# Altium schematic sheet MM_2.0_sch.SchDoc
size C; SheetNumber: 1; SheetTotal: 1
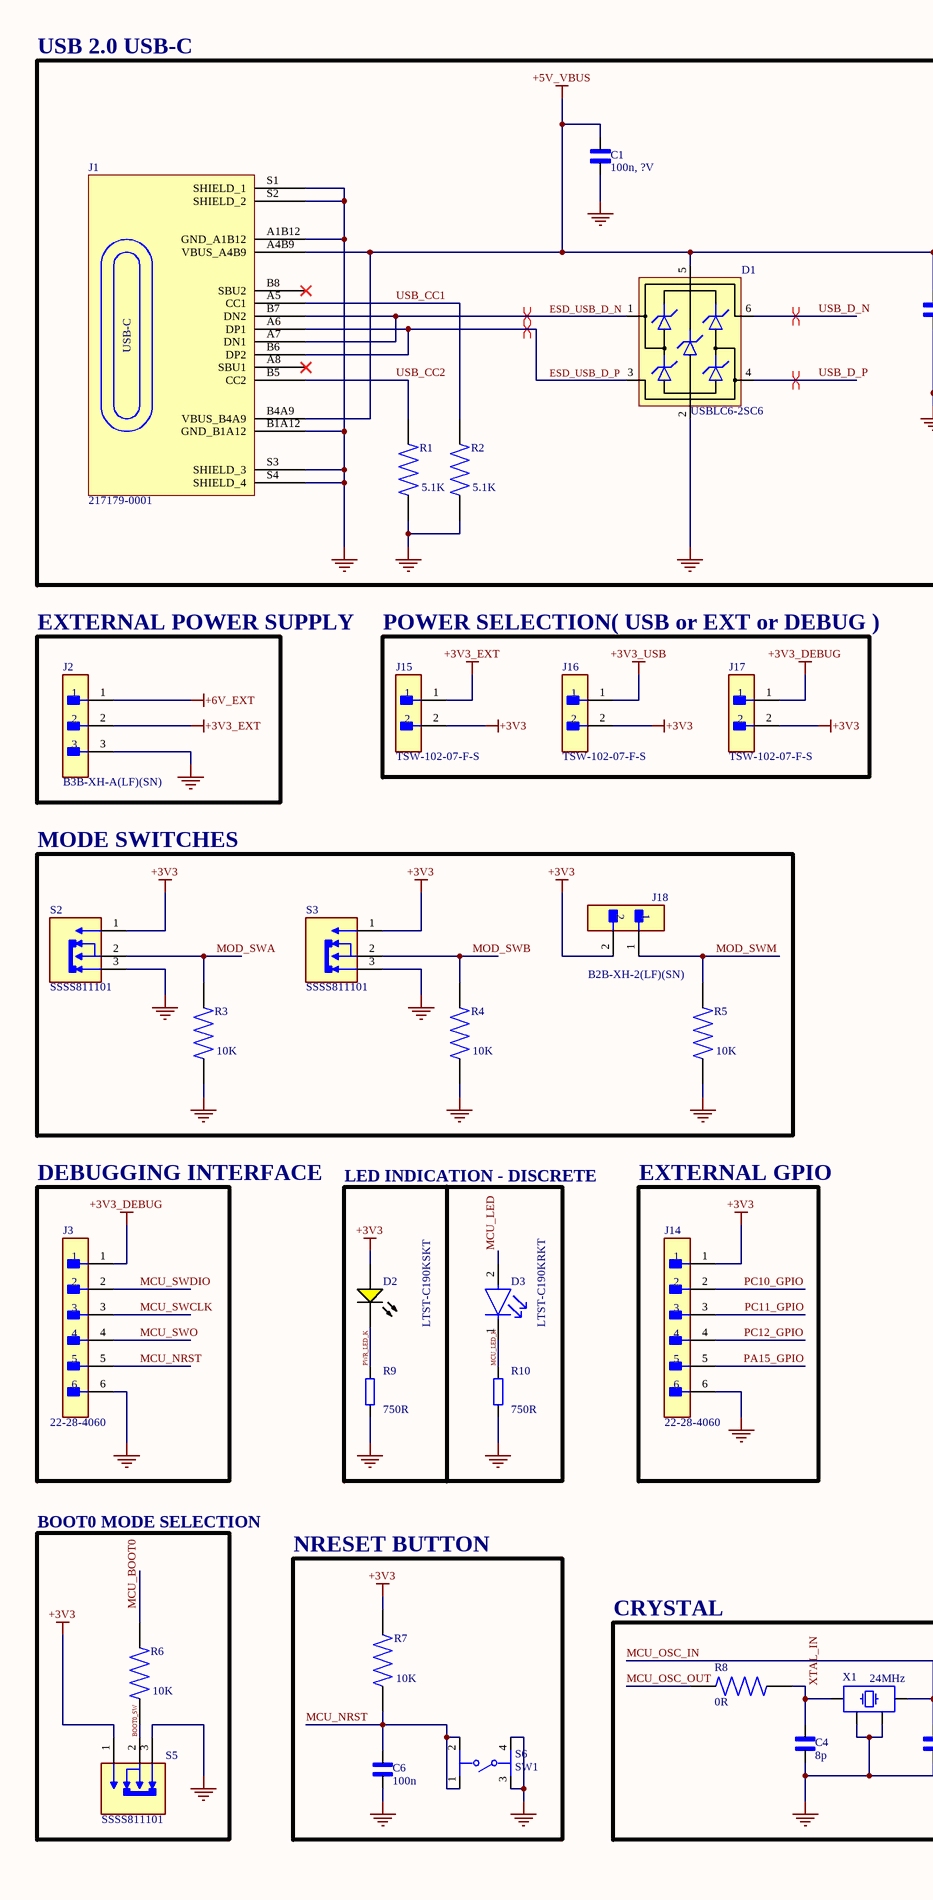
[diagram p0: MM_2.0_sch.SchDoc, left]
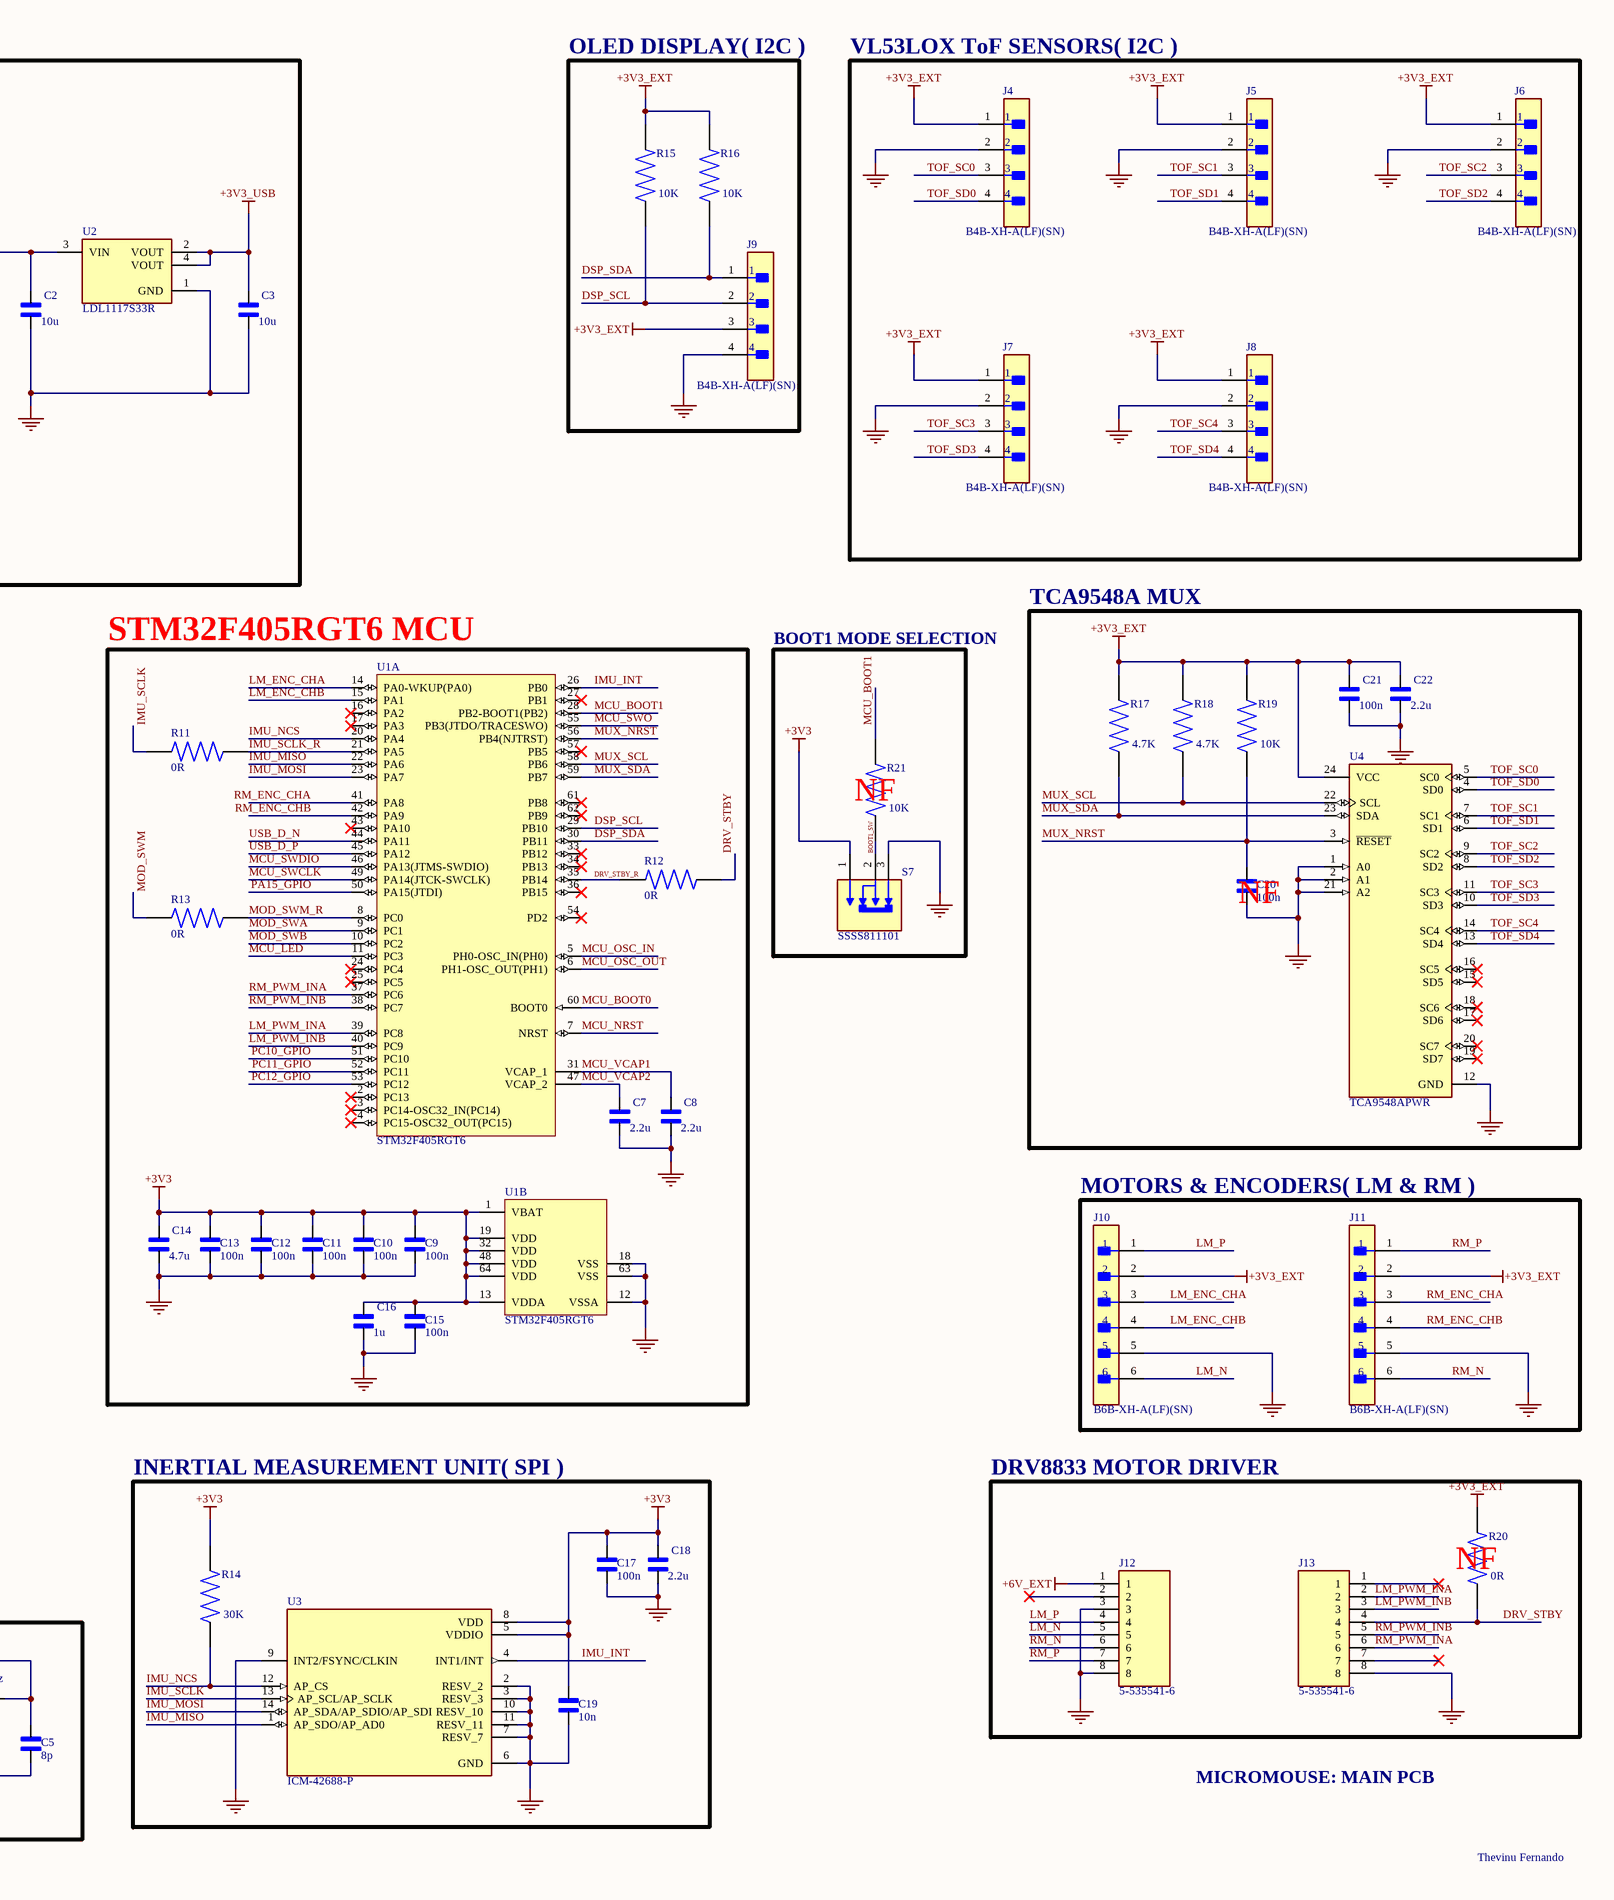
[diagram p1: MM_2.0_sch.SchDoc, right]

## Parts
C1  100n, ?V  [CAP_0402]
C2  10u  [CAPC2012X140N]
C3  10u  [CAPC2012X140N]
C4  8p  [CAP_0402]
C5  8p  [CAP_0402]
C6  100n  [CAP_0402]
C7  2.2u  [CL10A105KO8NNNC 4.7u 16V 603]
C8  2.2u  [CL10A105KO8NNNC 4.7u 16V 603]
C9  100n  [CAP_0402]
C10  100n  [CAP_0402]
C11  100n  [CAP_0402]
C12  100n  [CAP_0402]
C13  100n  [CAP_0402]
C14  4.7u  [CL10A105KO8NNNC 4.7u 16V 603]
C15  100n  [CAP_0402]
C16  1u  [CL10A105KO8NNNC 1u 16V 603]
C17  100n  [CAP_0402]
C18  2.2u  [CL10A105KO8NNNC 4.7u 16V 603]
C19  10n  [CAP_0402]
C20  100n  [CAP_0402]
C21  100n  [CAP_0402]
C22  2.2u  [CL10A105KO8NNNC 4.7u 16V 603]
D1  USBLC6-2SC6  [SOT95P280X145-6N]
D2  LTST-C190KSKT  [LTST-C190KSKT_V]
D3  LTST-C190KRKT  [FP-LTST-C190KRKT-MFG]
J1  217179-0001  [FP-2171790001-MFG USB-C 2.0]
J2  B3B-XH-A(LF)(SN)  [FP-B3B-XH-A_LF_SN-MFG]
J3  22-28-4060  [FP-22-28-4060-MFG]
J4  B4B-XH-A(LF)(SN)  [FP-B4B-XH-A_LF_SN-MFG]
J5  B4B-XH-A(LF)(SN)  [FP-B4B-XH-A_LF_SN-MFG]
J6  B4B-XH-A(LF)(SN)  [FP-B4B-XH-A_LF_SN-MFG]
J7  B4B-XH-A(LF)(SN)  [FP-B4B-XH-A_LF_SN-MFG]
J8  B4B-XH-A(LF)(SN)  [FP-B4B-XH-A_LF_SN-MFG]
J9  B4B-XH-A(LF)(SN)  [FP-B4B-XH-A_LF_SN-MFG]
J10  B6B-XH-A(LF)(SN)  [FP-B6B-XH-A_LF_SN-MFG]
J11  B6B-XH-A(LF)(SN)  [FP-B6B-XH-A_LF_SN-MFG]
J12  5-535541-6  [TE_5-535541-6]
J13  5-535541-6  [TE_5-535541-6]
J14  22-28-4060  [FP-22-28-4060-MFG]
J15  TSW-102-07-F-S  [FP-TSW-102-07-F-S-MFG]
J16  TSW-102-07-F-S  [FP-TSW-102-07-F-S-MFG]
J17  TSW-102-07-F-S  [FP-TSW-102-07-F-S-MFG]
J18  B2B-XH-2(LF)(SN)  [FP-B2B-XH-2_LF_SN-MFG]
R1  5.1K  [RES_ERJ2RKF1002X 100K 100mW 402]
R2  5.1K  [RES_ERJ2RKF1002X 100K 100mW 402]
R3  10K  [RES_ERJ2RKF1002X 100K 100mW 402]
R4  10K  [RES_ERJ2RKF1002X 100K 100mW 402]
R5  10K  [RES_ERJ2RKF1002X 100K 100mW 402]
R6  10K  [RES_ERJ2RKF1002X 100K 100mW 402]
R7  10K  [RES_ERJ2RKF1002X 100K 100mW 402]
R8  0R  [RES_ERJ2RKF1002X 100K 100mW 402]
R9  750R  [RES_0603]
R10  750R  [RES_0603]
R11  0R  [RES_ERJ2RKF1002X 100K 100mW 402]
R12  0R  [RES_ERJ2RKF1002X 100K 100mW 402]
R13  0R  [RES_ERJ2RKF1002X 100K 100mW 402]
R14  30K  [RES_ERJ2RKF1002X 100K 100mW 402]
R15  10K  [RES_ERJ2RKF1002X 100K 100mW 402]
R16  10K  [RES_ERJ2RKF1002X 100K 100mW 402]
R17  4.7K  [RES_ERJ2RKF1002X 100K 100mW 402]
R18  4.7K  [RES_ERJ2RKF1002X 100K 100mW 402]
R19  10K  [RES_ERJ2RKF1002X 100K 100mW 402]
R20  0R  [RES_ERJ2RKF1002X 100K 100mW 402]
R21  10K  [RES_ERJ2RKF1002X 100K 100mW 402]
S2  SSSS811101  [SW_SSSS811101]
S3  SSSS811101  [SW_SSSS811101]
S5  SSSS811101  [SW_SSSS811101]
S6  SW1  [FP-PTS645SM43SMTR92LFS-MFG]
S7  SSSS811101  [SW_SSSS811101]
U1  STM32F405RGT6  [STM-LQFP64_L]  (parts A,B of 2)
U2  LDL1117S33R  [FP-SOT223-0046067-IPC_A]
U3  ICM-42688-P  [PQFN50P300X250X97-14N]
U4  TCA9548APWR  [FP-PW0024A-IPC_A]
X1  24MHz  [XTAL_3225]

## Blocks framed on the sheet
USB 2.0 USB-C: C1-C3 D1 J1 R1 R2 U2
OLED DISPLAY( I2C ): J9 R15 R16
VL53LOX ToF SENSORS( I2C ): J4-J8
EXTERNAL POWER SUPPLY: J2
POWER SELECTION( USB or EXT or DEBUG ): J15-J17
NF: C20-C22 R17-R19 U4
STM32F405RGT6 MCU: C7-C16 R11-R13 U1
NF: R21 S7
MODE SWITCHES: J18 R3-R5 S2 S3
DEBUGGING INTERFACE: J3
LED INDICATION - DISCRETE: D2 D3 R9 R10
EXTERNAL GPIO: J14
MOTORS & ENCODERS( LM & RM ): J10 J11
INERTIAL MEASUREMENT UNIT( SPI ): C17-C19 R14 U3
NF: J12 J13 R20
BOOT0 MODE SELECTION: R6 S5
NRESET BUTTON: C6 R7 S6
CRYSTAL: C4 C5 R8 X1

## Nets
+3V3: C9.2 C10.2 C11.2 C12.2 C13.2 C14.1 C15.2 C16.1 C17.2 C18.1 C19.2 D2.1(A) J14.1 J15.2 J16.2 J17.2 J18.2 R7.2 R14.2 S2.1 S3.1 S5.1 S7.1 U1.1(VBAT) U1.13(VDDA) U1.19(VDD) U1.32(VDD) U1.48(VDD) U1.64(VDD) U3.5(VDDIO) U3.8(VDD)
+3V3_DEBUG: J3.1 J17.1
+3V3_EXT: C21.2 C22.1 J2.2 J4.1 J5.1 J6.1 J7.1 J8.1 J9.3 J10.2 J11.2 J15.1 R15.2 R16.2 R17.2 R18.2 R19.2 R20.2 U4.24(VCC)
+3V3_USB: C3.1 J16.1 U2.2(VOUT) U2.4(VOUT)
+5V_VBUS: C1.2 C2.1 D1.5(VBUS) J1.A4B9(VBUS_A4B9) J1.B4A9(VBUS_B4A9) U2.3(VIN)
+6V_EXT: J2.1 J12.1
GND: C1.1 C2.2 C3.2 C4.1 C5.1 C6.1 C7.2 C8.2 C9.1 C10.1 C11.1 C12.1 C13.1 C14.2 C15.1 C16.2 C17.1 C18.2 C19.1 C20.1 C21.1 C22.2 D1.2(GND) J1.A1B12(GND_A1B12) J1.B1A12(GND_B1A12) J1.S1(SHIELD_1) J1.S2(SHIELD_2) J1.S3(SHIELD_3) J1.S4(SHIELD_4) J2.3 J3.6 J4.2 J5.2 J6.2 J7.2 J8.2 J9.4 J10.5 J11.5 J12.3 J12.8 J13.8 J14.6 R1.1 R2.1 R3.1 R4.1 R5.1 R9.1 R10.1 S2.3 S3.3 S5.3 S6.3 S6.4 S7.3 U1.12(VSSA) U1.18(VSS) U1.63(VSS) U2.1(GND) U3.2(RESV_2) U3.3(RESV_3) U3.6(GND) U3.7(RESV_7) U3.9(INT2/FSYNC/CLKIN) U3.10(RESV_10) U3.11(RESV_11) U4.1(A0) U4.2(A1) U4.12(GND) U4.21(A2) X1.2 X1.4
BOOT0_SW: R6.1 S5.2
BOOT1_SW: R21.1 S7.2
DRV_STBY: J13.4 R12.2 R20.1
DRV_STBY_R: R12.1 U1.35(PB14)
DSP_SCL: J9.2 R15.1 U1.29(PB10)
DSP_SDA: J9.1 R16.1 U1.30(PB11)
ESD_USB_D_N: D1.1(IO1) J1.A7(DN1) J1.B7(DN2)
ESD_USB_D_P: D1.3(IO2) J1.A6(DP1) J1.B6(DP2)
IMU_INT: U1.26(PB0) U3.4(INT1/INT)
IMU_MISO: U1.22(PA6) U3.1(AP_SDO/AP_AD0)
IMU_MOSI: U1.23(PA7) U3.14(AP_SDA/AP_SDIO/AP_SDI)
IMU_NCS: R14.1 U1.20(PA4) U3.12(AP_CS)
IMU_SCLK: R11.1 U3.13(AP_SCL/AP_SCLK)
IMU_SCLK_R: R11.2 U1.21(PA5)
LM_ENC_CHA: J10.3 U1.14(PA0-WKUP(PA0))
LM_ENC_CHB: J10.4 U1.15(PA1)
LM_N: J10.6 J12.5
LM_P: J10.1 J12.4
LM_PWM_INA: J13.2 U1.39(PC8)
LM_PWM_INB: J13.3 U1.40(PC9)
MCU_BOOT0: R6.2 U1.60(BOOT0)
MCU_BOOT1: R21.2 U1.28(PB2-BOOT1(PB2))
MCU_LED: D3.2(A) U1.11(PC3)
MCU_LED_K: D3.1(C) R10.2
MCU_NRST: C6.2 J3.5 R7.1 S6.1 S6.2 U1.7(NRST)
MCU_OSC_IN: C5.2 U1.5(PH0-OSC_IN(PH0)) X1.3
MCU_OSC_OUT: R8.1 U1.6(PH1-OSC_OUT(PH1))
MCU_SWCLK: J3.3 U1.49(PA14(JTCK-SWCLK))
MCU_SWDIO: J3.2 U1.46(PA13(JTMS-SWDIO))
MCU_SWO: J3.4 U1.55(PB3(JTDO/TRACESWO))
MCU_VCAP1: C8.1 U1.31(VCAP_1)
MCU_VCAP2: C7.1 U1.47(VCAP_2)
MOD_SWA: R3.2 S2.2 U1.9(PC1)
MOD_SWB: R4.2 S3.2 U1.10(PC2)
MOD_SWM: J18.1 R5.2 R13.1
MOD_SWM_R: R13.2 U1.8(PC0)
MUX_NRST: C20.2 R19.1 U1.56(PB4(NJTRST)) U4.3(~{RESET})
MUX_SCL: R18.1 U1.58(PB6) U4.22(SCL)
MUX_SDA: R17.1 U1.59(PB7) U4.23(SDA)
PA15_GPIO: J14.5 U1.50(PA15(JTDI))
PC10_GPIO: J14.2 U1.51(PC10)
PC11_GPIO: J14.3 U1.52(PC11)
PC12_GPIO: J14.4 U1.53(PC12)
PWR_LED_K: D2.2(K) R9.2
RM_ENC_CHA: J11.3 U1.41(PA8)
RM_ENC_CHB: J11.4 U1.42(PA9)
RM_N: J11.6 J12.6
RM_P: J11.1 J12.7
RM_PWM_INA: J13.6 U1.37(PC6)
RM_PWM_INB: J13.5 U1.38(PC7)
TOF_SC0: J4.3 U4.5(SC0)
TOF_SC1: J5.3 U4.7(SC1)
TOF_SC2: J6.3 U4.9(SC2)
TOF_SC3: J7.3 U4.11(SC3)
TOF_SC4: J8.3 U4.14(SC4)
TOF_SD0: J4.4 U4.4(SD0)
TOF_SD1: J5.4 U4.6(SD1)
TOF_SD2: J6.4 U4.8(SD2)
TOF_SD3: J7.4 U4.10(SD3)
TOF_SD4: J8.4 U4.13(SD4)
USB_CC1: J1.A5(CC1) R2.2
USB_CC2: J1.B5(CC2) R1.2
USB_D_N: D1.6(IO1) U1.44(PA11)
USB_D_P: D1.4(IO2) U1.45(PA12)
XTAL_IN: C4.2 R8.2 X1.1

Not connected (* = marked no-connect by the designer): J1 A8(SBU1)* B8(SBU2)*; J12 2*; J13 1* 7*; U1 2(PC13)* 3(PC14-OSC32_IN(PC14))* 4(PC15-OSC32_OUT(PC15))* 16(PA2)* 17(PA3)* 24(PC4)* 25(PC5)* 27(PB1)* 33(PB12)* 34(PB13)* 36(PB15)* 43(PA10)* 54(PD2)* 57(PB5)* 61(PB8)* 62(PB9)*; U4 15(SD5)* 16(SC5)* 17(SD6)* 18(SC6)* 19(SD7)* 20(SC7)*

## Layout directives
differential pair; differential pair class DIFF_USB: USB_D_N, USB_D_P
differential pair; differential pair class ESD_DIFF_USB: ESD_USB_D_N, ESD_USB_D_P

## Notes on the sheet
- BOOT1 MODE SELECTION
- TCA9548A MUX
- DRV8833 MOTOR DRIVER
- MICROMOUSE: MAIN PCB
- Thevinu Fernando
- (in symbol 217179-0001) USB-C

## Library data of the parts
C1 C4-C6 C9-C13 C15 C17 C19-C21 = CL05B104KO5NNNC: 0.1 ÂµF Â±10% 16V Ceramic Capacitor X7R 0402 (1005 Metric); MF: Samsung; SnapEDA_Link: https://www.snapeda.com/parts/CL05B104KO5NNNC/Samsung/view-part/?ref=snap; Package: SMD-2-2 Samsung; Value: *; MP: CL05B104KO5NNNC; Check_prices: https://www.snapeda.com/parts/CL05B104KO5NNNC/Samsung/view-part/?ref=eda
C2 C3 = CL21B106KOQNNNE: 10 ÂµF Â±10% 16V Ceramic Capacitor X7R 0805 (2012 Metric); MF: Samsung Electro-Mechanics; SnapEDA_Link: https://www.snapeda.com/parts/CL21B106KOQNNNE/Samsung+Electro-Mechanics/view-part/?ref=snap; Package: 0805 Samsung; Value: *; MP: CL21B106KOQNNNE; Check_prices: https://www.snapeda.com/parts/CL21B106KOQNNNE/Samsung+Electro-Mechanics/view-part/?ref=eda
C7 C8 C14 C18 C22 = CL10A475KO8NNNC: 4.7 ÂµF Â±10% 16V Ceramic Capacitor X5R 0603 (1608 Metric); MF: Samsung Electro-Mechanics; SnapEDA_Link: https://www.snapeda.com/parts/CL10A475KO8NNNC/Samsung/view-part/?ref=snap; Package: 1608-2 SAMSUNG; Value: *; MP: CL10A475KO8NNNC; Check_prices: https://www.snapeda.com/parts/CL10A475KO8NNNC/Samsung/view-part/?ref=eda
C16 = CL10A105KO8NNNC: 1uF; 16V; X5R; MLCC; Â±10%; SMD; Capacitor: ceramic; 0603; -55Ã·85Â°C; MF: Samsung Electro-Mechanics; SnapEDA_Link: https://www.snapeda.com/parts/CL10A105KO8NNNC/Samsung/view-part/?ref=snap; Package: 1608-2 SAMSUNG; Value: *; MP: CL10A105KO8NNNC; Check_prices: https://www.snapeda.com/parts/CL10A105KO8NNNC/Samsung/view-part/?ref=eda
D1 = USBLC6-2SC6: Low-Capacitance ESD Protection USB; Manufacturer: STMicroelectronics; Manufacturer Part Number: USBLC6-2SC6; Distributor Link: https://www.mouser.de/ProductDetail/STMicroelectronics/USBLC6-2SC6?qs=po45yt2pPpu%2FhNIlwQdTlg%3D%3D
D2 = CMP-1674-00009-1: LED Uni-Color Yellow, 75 mW, 30 mA, -30 to 85 degC, 2-Pin SMD, RoHS, Tape and Reel; Voltage Rating: 50 V; Case\Package: 0603; Power Rating: 100 mW; Tolerance: 1%; Resistance: 12 kohm; Packaging: Tape and Reel; RoHSCompliant: true; Height: 0.45 mm; Max Operating Temperature: 155 degC; Mount: Surface Mount; DatasheetVersion: Rev. I, 10/2012; Min Operating Temperature: -55 degC; PackageReference: C190KSKT; ComponentLink1Description: Manufacturer URL; Length: 1.6 mm; REACH SVHC: No SVHC; Case Code (Imperial): 0603; Voltage Rating (DC): 50 V; PackageDescription: 2-Pin Surface Mount Device, Body 1.6 x 0.8 mm; Case Code (Metric): 1608; Package Quantity: 5000; ComponentLink2Description: Datasheet; Width: 0.8 mm; Pins: 2; ComponentLink2URL: http://optoelectronics.liteon.com/upload/download/DS-22-99-0189/S_110_LTST-C190KSKT.pdf; ComponentLink1URL: http://www.us.liteon.com/
D3 = CMP-1674-00011-2: LED RED CLEAR CHIP SMD; Reverse Voltage: 5V; Viewing Angle: 130°; Power Rating: 75mW; Test Current: 20mA; Number of Elements: 1; Lens Color: Colorless; Wavelength: 639nm; Dominant Wavelength: 631nm; Lens Style: Diffused; Forward Current: 30mA; Forward Voltage: 2.4V; Luminous Intensity: 54mcd; Color: Red; Case Code (Imperial): 0603; Lens Transparency: Clear; Lead Free: Lead Free; Package Quantity: 1; Packaging: Tape and Reel; Max Operating Temperature: 85°C; Number of Pins: 2; Height: 0.8mm; Case/Package: 0603; Number of LEDs: 1; Width: 0.8mm; Case Code (Metric): 1608; Depth: 0.8mm; Mount: Surface Mount; Radiation Hardening: No; Length: 1.6mm; Illumination Color: Red; Power Dissipation: 75mW; Min Operating Temperature: -55°C
J1 = 217179-0001: CONN RCP USB2.0 TYP C 24P SMD RA; Manufacturer: Molex; Supplier: Digikey; Supplier Part Number: 900-2171790001CT-ND; Manufacturer Part Number: 217179-0001; RoHS: No; Category: Connectors; Stock: 7228; Pricing: 1=0.9, 10=0.745, 100=0.6212 (USD); LCSC Part Number: C3197684
J2 = CMP-17439-000014-3: CONN HEADER VERT 3POS 2.5MM; Max Voltage Rating (DC): 250V; Number of Positions: 3; Current Rating: 3A; Gender: Male; Wire/Cable Gauge: 22AWG; Contact Resistance: 20mR; Insulation Resistance: 1GR; Insulation Material: Nylon; Contact Plating: Tin; Depth: 5.75mm; Contact Type: Male Pin; Max Operating Temperature: 85°C; Insulation Color: Natural; Voltage Rating (AC): 250V; Color: Natural; Connector Type: Header; Orientation: Straight; Fastening Type: Detent; Housing Color: White; Min Operating Temperature: -25°C; Termination: Solder; Voltage Rating: 250V; Series: XH; Pitch: 2.5mm; Contact Shape: Square; Number of Rows: 1; Lead Free: Lead Free; Packaging: Bulk; Mount: Through Hole; Flammability Rating: UL94 V-0; Max Voltage Rating (AC): 250V; REACH SVHC: No SVHC; Housing Material: Polyamide; Contact Material: Brass; Lead Pitch: 2.5mm; Contact Finish - Mating: TIN; Length: 9.9mm; Max Current Rating: 3A; Number of Contacts: 3
J3 J14 = f2cb566baf1c37ab5a3b8e90bbeafd6: CONN HEADER VERT 6POS 2.54MM; Voltage Rating: 250V; Current Rating: 4A; Number of Contacts: 6; Max Voltage Rating (DC): 250.25kV; Gender: Male; Contact Resistance: 20mR; Connector Type: Male Pin; Color: Black; Max Voltage Rating (AC): 250V; Pitch: 2.54mm; Orientation: Straight; Max Operating Temperature: 75°C; Contact Plating: Tin; Depth: 2.49mm; Contact Type: Male Pin; Number of Positions: 6; Length: 15.24mm; Packaging: Bulk; Mount: Through Hole; Housing Material: Thermoplastic; Housing Color: Black; Termination: Solder; Contact Material: Brass; Min Operating Temperature: 0°C; Series: KK® 42375; Number of Rows: 1; Package Quantity: 1; RoHS Compliant: Yes; Contact Mating Length: 0.24inch
J4-J9 = CMP-17439-000250-1: CONN HEADER VERT 4POS 2.5MM; Number of Contacts: 4; Contact Resistance: 20mR; Voltage Rating: 250V; Max Current Rating: 3A; Gender: Male; Wire/Cable Gauge: 22AWG; Mated Stacking Heights: 9.8mm; Insulation Resistance: 1GR; Orientation: Straight; Contact Type: Male Pin; Contact Finish - Mating: TIN; Series: XH; Max Voltage Rating (AC): 250V; Lead Pitch: 2.5mm; Contact Shape: Square; Insulation Color: Natural; Termination: Solder; Lead Free: Lead Free; Voltage Rating (AC): 250V; Number of Rows: 1; Flammability Rating: UL94 V-0; Number of Positions: 4; Max Operating Temperature: 85°C; Package Quantity: 500; Mount: Through Hole; REACH SVHC: No SVHC; Connector Type: Header; Insulation Material: Nylon; Fastening Type: Detent; Min Operating Temperature: -25°C; Housing Color: White; Packaging: Bulk; Contact Plating: Tin; Contact Material: Brass; Max Voltage Rating (DC): 250V; Housing Material: Polyamide; Color: Natural; Material: Polyamide; Pitch: 2.5mm; Depth: 5.75mm; Current Rating: 3A; Length: 12.4mm
J10 J11 = CMP-17439-000076-1: CONN HEADER VERT 6POS 2.5MM
J12 J13 = 5-535541-6: Receptacle, 2.54mm 8-Way, 1 Row, PCB Board-Board, AMPMODU Mod IV Series | TE Connectivity 5-535541-6; Product_Type: Connector; Number_of_Positions: 8; Centerline_Pitch: 2.54 mm[.1 in]; SnapEDA_Link: https://www.snapeda.com/parts/5-535541-6/TE+Connectivity+AMP+Connectors/view-part/?ref=snap; Package: None; Value: *; MF: TE Connectivity; MP: 5-535541-6; EU_RoHS_Compliance: Compliant; Check_prices: https://www.snapeda.com/parts/5-535541-6/TE+Connectivity+AMP+Connectors/view-part/?ref=eda
J15-J17 = CMP-02766-001458-1: CONN HEADER VERT 2POS 2.54MM; Gender: Male; Max Current Rating: 7.6A; Number of Contacts: 2; Max Voltage Rating (AC): 550V; Orientation: Straight; Depth: 2.54mm; Series: TSW; Package Quantity: 1; Min Operating Temperature: -55°C; Max Operating Temperature: 125°C; Contact Type: Male Pin; Contact Shape: Square; Color: Black; Housing Color: Black; Connector Type: Header; Fastening Type: Pull; Radiation Hardening: No; Pitch: 2.54mm; Housing Material: Polyester; Mount: Through Hole; Number of Positions: 2; Number of Rows: 1; Contact Material: Bronze; Insulation Color: Black; Contact Finish - Mating: GOLD; Termination: Solder; Insulation Material: PBT; Length: 5.08mm; Flammability Rating: UL94 V-0; Contact Mating Length: 0.23inch; REACH SVHC: No SVHC; Contact Plating: Gold; RoHS Compliant: Yes; Packaging: Bulk
J18 = CMP-17439-000499-1: CONN HEADER VERT 2POS 2.5MM; Shape: Straight; Number of Positions: 2; Voltage Rating: 250V; Current Rating: 3A; Termination: Press-Fit; Contact Shape: Square; Width: 5.75mm; Fastening Type: Detent; Flammability Rating: UL94 V-0; Insulation Color: Natural; Housing Material: Nylon; Contact Type: Male Pin; Height: 7mm; Number of Rows: 1; Connector Type: Header; Mount: Through Hole; Contact Material: Brass; Series: XH; Max Operating Temperature: 85°C; Insulation Material: Nylon; Length: 7.4mm; Pitch: 2.5mm; Packaging: Bulk; Number of Poles: 2; Contact Finish - Mating: TIN; Min Operating Temperature: -25°C
R1-R8 R11-R21 = ERJ2RKF1002X: 10 kOhms 1% 0.1W, 1/10W Chip Resistor 0402 (1005 Metric) Automotive AEC-Q200 Thick Film; MF: Panasonic; MP: ERJ-2RKF1002X; Package: 1005-2 Panasonic; Price: None; Check_prices: https://www.snapeda.com/parts/ERJ-2RKF1002X/Panasonic%20Electronic%20Components/view-part/78636/?ref=eda; Value: *; SnapEDA_Link: https://www.snapeda.com/parts/ERJ-2RKF1002X/Panasonic%20Electronic%20Components/view-part/78636/?ref=snap; Availability: In Stock
R9 R10 = RES_0603: Resistor SMD 0603; Manufacturer: *; Manufacturer Part Number: *; Distributor Link: *; LCSC: *
S2 S3 S5 S7 = SSSS811101: Switch Slide SP Side Slide 0.3A 5VDC 10000Cycles Gull Wing SMD T/R; MF: ALPS; SnapEDA_Link: https://www.snapeda.com/parts/SSSS811101/ALPS/view-part/?ref=snap; Package: None; Value: *; MP: SSSS811101; Check_prices: https://www.snapeda.com/parts/SSSS811101/ALPS/view-part/?ref=eda
S6 = PTS645SM43SMTR92LFS: SWITCH TACTILE SPST-NO 0.05A 12V; Contact Resistance: 100mR; Throw Configuration: SPST; Illumination Type: Non-Illuminated; Mechanical Life: 100000Cycles; Current Rating: 50mA; Switch Function: Off-Mom; Actuator Length: 0.85mm; Actuator Material: Nylon; Actuator Type: Standard; Operating Force: 160gf; Min Operating Temperature: -20°C; REACH SVHC: No SVHC; Termination: Gull Wing; Case/Package: SMD/SMT; Packaging: Tape and Reel; Mount: Surface Mount; Voltage Rating (DC): 12V; Orientation: Straight; Lead Free: Lead Free; Contact Material: Silver; Color: Black; Max Current Rating: 50mA; Contact Plating: Silver; Depth: 9mm; Package Quantity: 1; Max Voltage Rating (DC): 12V; Length: 6mm; Max Operating Temperature: 60°C
U1 = CMP-0243-00019-3: ARM Cortex-M4 32-bit MCU+FPU, 210 DMIPS, 1024 kB Flash, 192 kB Internal RAM, 51 I/Os, 64-pin LQFP, -40 to 85 degC, Tray; Manufacturer: STMicroelectronics; Supply Voltage(Vcc) min (V): 1.8; Supply Voltage(Vcc) max (V): 3.6; Internal RAM Size (kB): 192; I/Os (High Current): 51; D/A Converter: 2x12-bit; FLASH Size (Prog) (kB): 1024; Operating Frequency(F) (Processor speed) (MHz): 168; ComponentLink2Description: Datasheet; PackageVersion: Rev. 4, 06/2013; DatasheetVersion: Rev. 4; Core: ARM Cortex-M4; ComponentLink2URL: http://www.st.com/st-web-ui/static/active/en/resource/technical/document/datasheet/DM00037051.pdf; PackageReference: LQFP64; Packing: Tray; ComponentLink1Description: Manufacturer URL; ComponentLink3URL: http://www.st.com/st-web-ui/static/active/en/resource/technical/document/datasheet/DM00037051.pdf; ComponentLink3Description: Package Specification; Mounting Technology: Surface Mount; ComponentLink1URL: http://www.st.com/web/en/home.html; PackageDescription: 64-Pin Low Profile Quad Flat Package, 10 x 10 mm Body, 0.5 mm Pitch; PartNumber: STM32F405RGT6
U2 = CMP-12153-000006-1: IC REG LINEAR 3.3V 1.2A SOT223; Manufacturer: STMicroelectronics; Output Type: Fixed; Min Supply Voltage: 2.6V; Number Of Outputs: 1; Dropout Voltage: 350mV; Output Current: 2A; Nominal Supply Current: 250uA; Standoff Height: 0.02mm; Max Supply Voltage: 18V; Max Junction Temp: +125°C; Accuracy Percentage: 2%; Automotive: No; Device Class L2: Power Management ICs; Height: 1.9mm; Octopart: https://octopart.com/ldl1117s33r-stmicroelectronics-81876163; Output Voltage: 3.3V; Package: SOT223-0046067; Lead Free: Yes; Temperature Range Low: -40°C; Category: IC; Device Class L1: Integrated Circuits (ICs); Ipc Land Pattern Name: SOT230P700X190-4; Mouser Description: LDL1117 Series 1.2 A 3.3 V High PSRR LDO Linear Voltage Regulator-SOT-223; ComponentLink2Description: Datasheet; ComponentLink2URL: https://www.st.com/resource/en/datasheet/ldl1117.pdf; Device Class L3: Voltage Regulators - Linear; Manufacturer Part Number: LDL1117S33R; Temperature Range High: +125°C; Digikey Description: IC REG LINEAR 3.3V 1.2A SOT223; Temperature: -40°C to +125°C; RoHS: TRUE
U3 = ICM-42688-P: Accelerometer, Gyroscope, 6 Axis Sensor Output; Package: None; MP: ICM-42688-P; Value: *; Availability: Unavailable; Price: None
U4 = CMP-04892-000002-1: IC I2C SW 8CH W/RESET 24TSSOP; Manufacturer: Texas Instruments; Number Of Circuits: 1; Mux Demux Ratio: 1:8; Nominal Supply Current: 2-50uA; Interface: I2C,SMBus; Min Supply Voltage: 1.65V; Standoff Height: 0.05mm; Max Supply Voltage: 5.5V; Device Class L2: Interface ICs; ComponentLink2Description: Datasheet; Ipc Land Pattern Name: SOP65P640X120-24; Category: IC; Device Class L1: Integrated Circuits (ICs); Manufacturer Part Number: TCA9548APWR; RoHS: TRUE; Temperature Range High: +85°C; Digikey Description: IC I2C SW 8CH W/RESET 24TSSOP; Temperature Range Low: -40°C; Lead Free: Yes; Package: PW0024A; ComponentLink2URL: http://www.ti.com/lit/ds/symlink/tca9548a.pdf; Device Class L3: Multiplexers; Ambient Temperature Range Low: -40°C; Mouser Description: Low-Voltage 8-Channel I2C Switch With Reset 24-TSSOP -40 to 85; Temperature: -40°C to +85°C; Octopart: https://octopart.com/tca9548apwr-texas+instruments-22266789; Ambient Temperature Range High: +85°C; Automotive: No; Height: 1.2mm
X1 = TSX-3225_24.0000MF15X-AC: Crystal SMD 24MHz 10PPM 7pF 3225; Manufacturer: Epson; Manufacturer Part Number: TSX-3225 24.0000MF15X-AC